# EAGLE design 1switch (EAGLE 6.6.0)
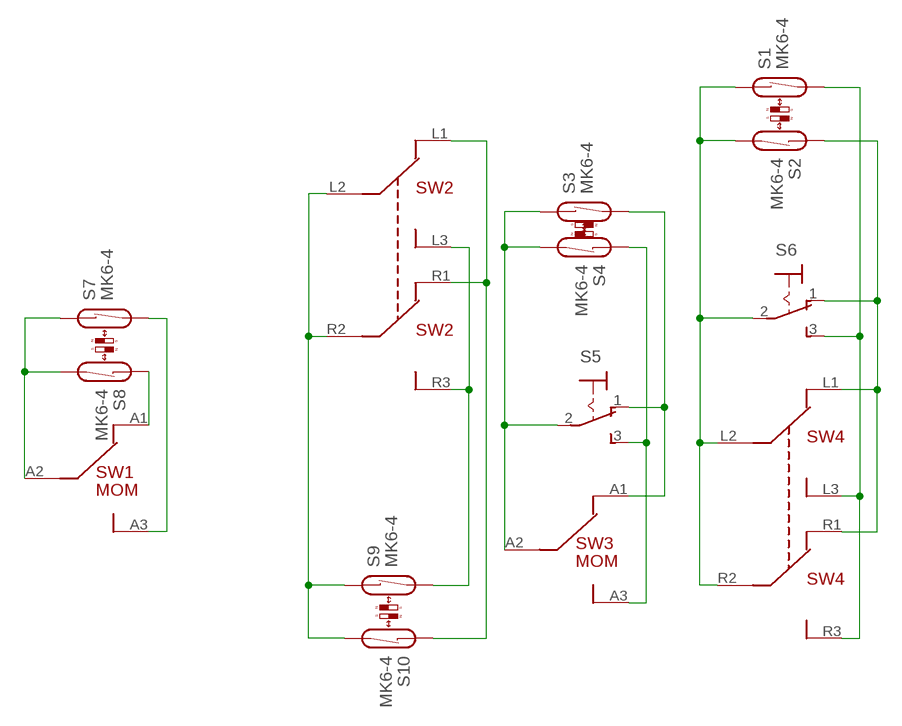
[diagram p0: schematic, sheet 1]

## Parts
S1  MK6-4  REED-SWITCH-MK6-4  [MK6-4]
S2  MK6-4  REED-SWITCH-MK6-4  [MK6-4]
S3  MK6-4  REED-SWITCH-MK6-4  [MK6-4]
S4  MK6-4  REED-SWITCH-MK6-4  [MK6-4]
S5  M9040P7101V2  [7101MD9V21]
S6  M9040P7101V2  [7101MD9V21]
S7  MK6-4  REED-SWITCH-MK6-4  [MK6-4]
S8  MK6-4  REED-SWITCH-MK6-4  [MK6-4]
S9  MK6-4  REED-SWITCH-MK6-4  [MK6-4]
S10  MK6-4  REED-SWITCH-MK6-4  [MK6-4]
SW1  SPDT8I  [SPDT8I]
SW2  DPDT8I  [DPDT8I]
SW3  SPDT8I  [SPDT8I]
SW4  DPDT8I  [DPDT8I]

## Nets
N$1: S8.1 SW1.A1
N$2: S7.2 SW1.A3
N$3: S7.1 S8.2 SW1.A2
N$4: S9.1 S10.2 SW2.L2(A2) SW2.R2(B2)
N$5: S3.1 S4.2 S5.2(P) SW3.A2
N$6: S9.2 SW2.L3(A3) SW2.R3(B3)
N$7: S10.1 SW2.L1(A1) SW2.R1(B1)
N$8: S4.1 S5.3(S) SW3.A3
N$9: S3.2 S5.1(O) SW3.A1
N$10: S1.1 S2.2 S6.2(P) SW4.L2(A2) SW4.R2(B2)
N$11: S1.2 S6.3(S) SW4.L3(A3) SW4.R3(B3)
N$12: S2.1 S6.1(O) SW4.L1(A1) SW4.R1(B1)

## Library data of the parts
S1-S4 S7-S10 = switch-reed:REED-SWITCH-: Reed Sensor; OC_FARNELL: unknown
S5 S6 = switch:M9040P: TOGGLE SWITCH Marquardt
SW1 SW3 = dec-con:SPDT8I: SPDT Momentary, as used in 8/i.
SW2 SW4 = dec-con:DPDT8I: DPDT switch as used in 8/i.

## Board
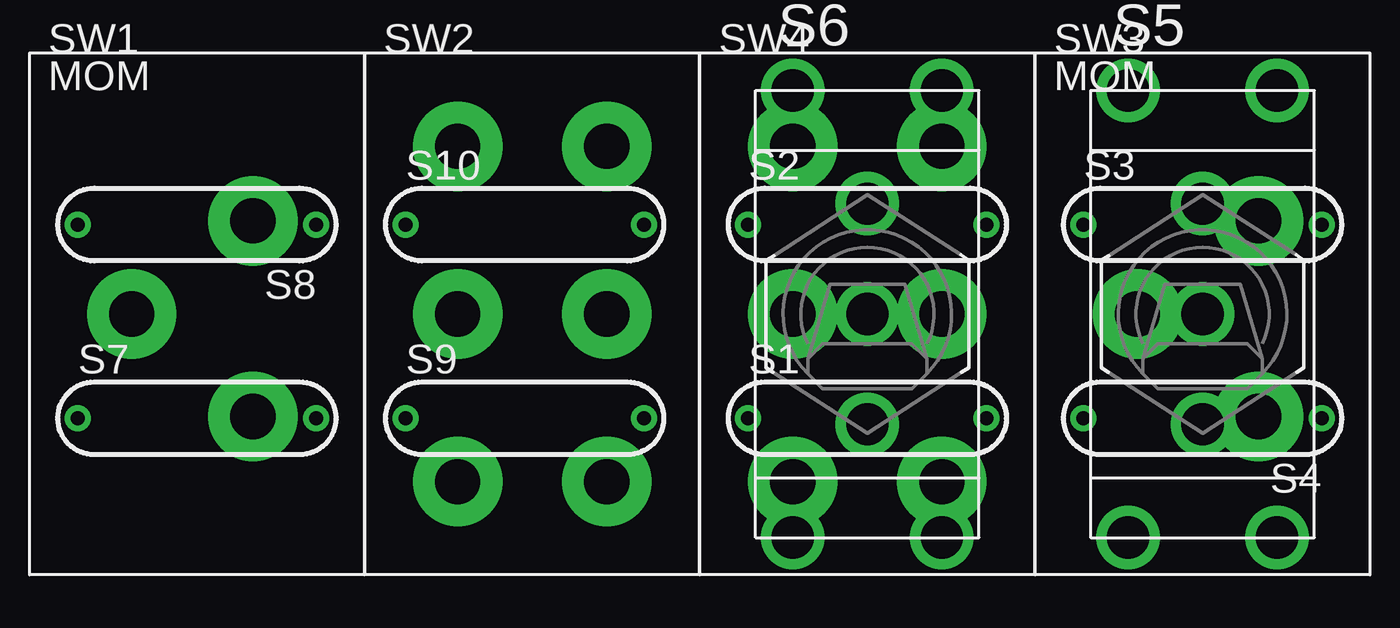
[diagram p1: board, top side]
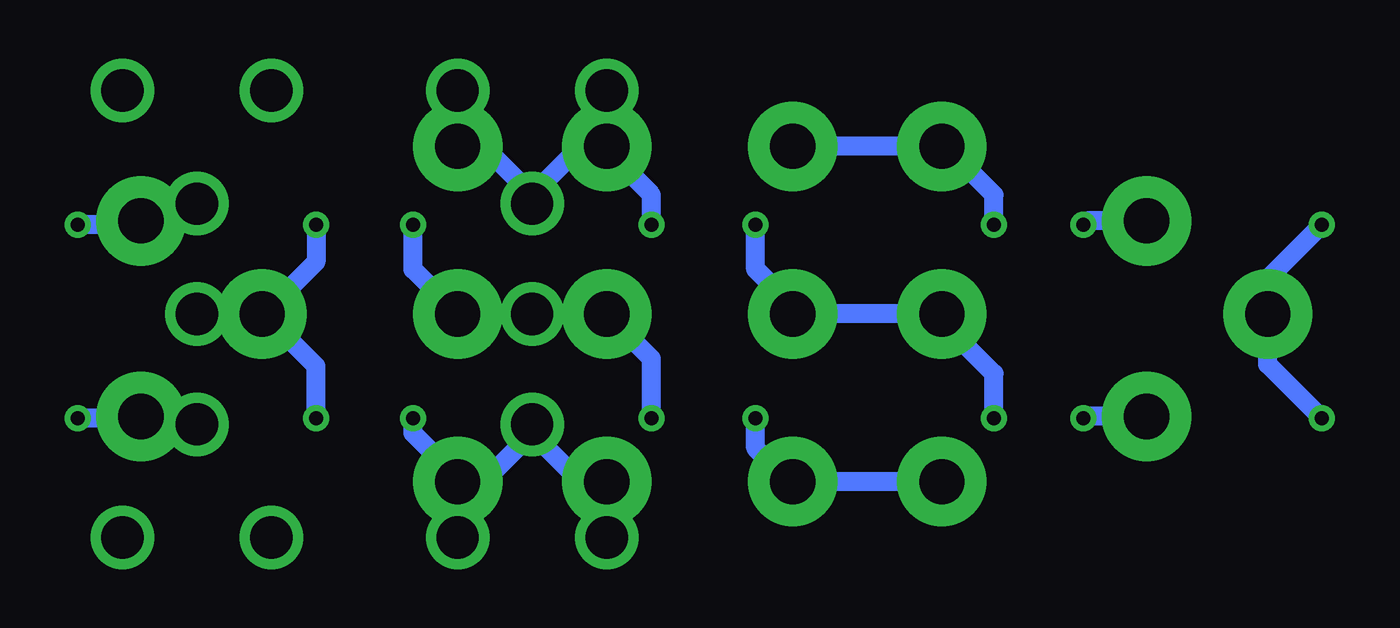
[diagram p2: board, bottom side, seen from below]

No outline drawn. Coordinates in mm, seen from the top.
Copper layers (1+16): Top 0.035mm / dielectric 1.5mm / Bottom 0.035mm
Design rules "16mils": minimum track width 16mil, minimum drill 32mil, track to track 15mil, track to pad 10mil, pad to pad 10mil, via to via 10mil, smd to smd 10mil, copper to edge 13mil, drill to drill 10mil, minimum pad ring 10mil, minimum via ring 8mil, stop-mask expansion 0mil, vias tented up to drill 0mil, thermal gap 10mil

### Footprints (pad centres in the part's own frame; a part is rotated, then mirrored left to right if it is on the bottom)
MK6-4 = drill 0.6 pad 1.016: 1 -5.08,0; 2 5.08,0
7101MD9V21 = drill 1.803: 1 0,4.699; 2 0,0; 3 0,-4.699; GND@1 -3.175,9.525; GND@2 3.175,9.525; GND@3 -3.175,-9.525; GND@4 3.175,-9.525
SPDT8I = drill 1.93 pad 3.81: A1 2.381,3.969; A2 -2.778,0; A3 2.381,-4.366
DPDT8I = drill 1.93 pad 3.81: L1 -3.175,7.144; L2 -3.175,0; L3 -3.175,-7.144; R1 3.175,7.144; R2 3.175,0; R3 3.175,-7.144

### Placement (x,y rotation side)
S1  35.56,6.99 0 top
S2  35.56,15.24 0 top
S3  49.85,15.24 0 top
S4  49.85,6.99 180 top
S5  49.85,11.43 0 top
S6  35.56,11.43 0 top
S7  6.99,6.99 0 top
S8  6.99,15.24 180 top
S9  20.95,6.99 0 top
S10  20.95,15.24 0 top
SW1  6.99,11.43 0 top
SW2  21.27,11.43 0 top
SW3  49.85,11.43 0 top
SW4  35.56,11.43 0 top

### Tracks (layer width: path | path; a pad name or v marks a point on that pad's centre or on a via)
N$1
  Bottom 0.813: SW1.A1 11.91,15.4 S8.1
N$2
  Bottom 0.813: SW1.A3 11.99,7.06 S7.2
N$3
  Bottom 0.813: S8.2 4.21,12.94 SW1.A2 4.21,9.29 S7.1
N$4
  Bottom 0.813: S9.1 15.88,8.89 18.41,11.43 SW2.L2 24.13,11.43 | 24.13,11.43 SW2.R2 | S10.2 26.04,13.34 24.13,11.43
N$5
  Bottom 0.813: 46.99,11.43 SW3.A2 S5.2 | S4.2 44.77,9.21 46.99,11.43 | S3.1 44.77,13.65 46.99,11.43
N$6
  Bottom 0.813: 24.29,4.29 SW2.R3 24.61,4.29 26.04,5.71 S9.2 | 24.29,4.29 24.13,4.45 23.97,4.29 SW2.L3 | 24.29,4.29
N$7
  Bottom 0.813: 17.94,18.57 SW2.L1 | 17.94,18.57 SW2.R1 | S10.1 15.88,16.51 17.94,18.57
N$8
  Bottom 0.813: 52.07,6.99 52.15,7.06 SW3.A3 | 52.07,6.99 S4.1 | S5.3 51.82,6.73 52.07,6.99
N$9
  Bottom 0.813: 52.07,15.24 SW3.A1 | S5.1 51.18,16.13 52.07,15.24 | 52.07,15.24 S3.2
N$10
  Bottom 0.813: S2.2 40.64,13.34 SW4.R2 S6.2 SW4.L2 30.48,9.53 S1.1
N$11
  Bottom 0.813: 35.56,6.35 S6.3 | SW4.L3 33.5,4.29 35.56,6.35 | 35.56,6.35 37.62,4.29 SW4.R3 38.73,4.45 40.64,6.35 S1.2
N$12
  Bottom 0.813: S2.1 30.48,16.51 32.38,18.41 SW4.L1 33.5,18.57 35.56,16.51 | 35.56,16.51 S6.1 | SW4.R1 37.62,18.57 35.56,16.51